# Altium schematic sheet LDP_DS_V2.0.SchDoc
size A4
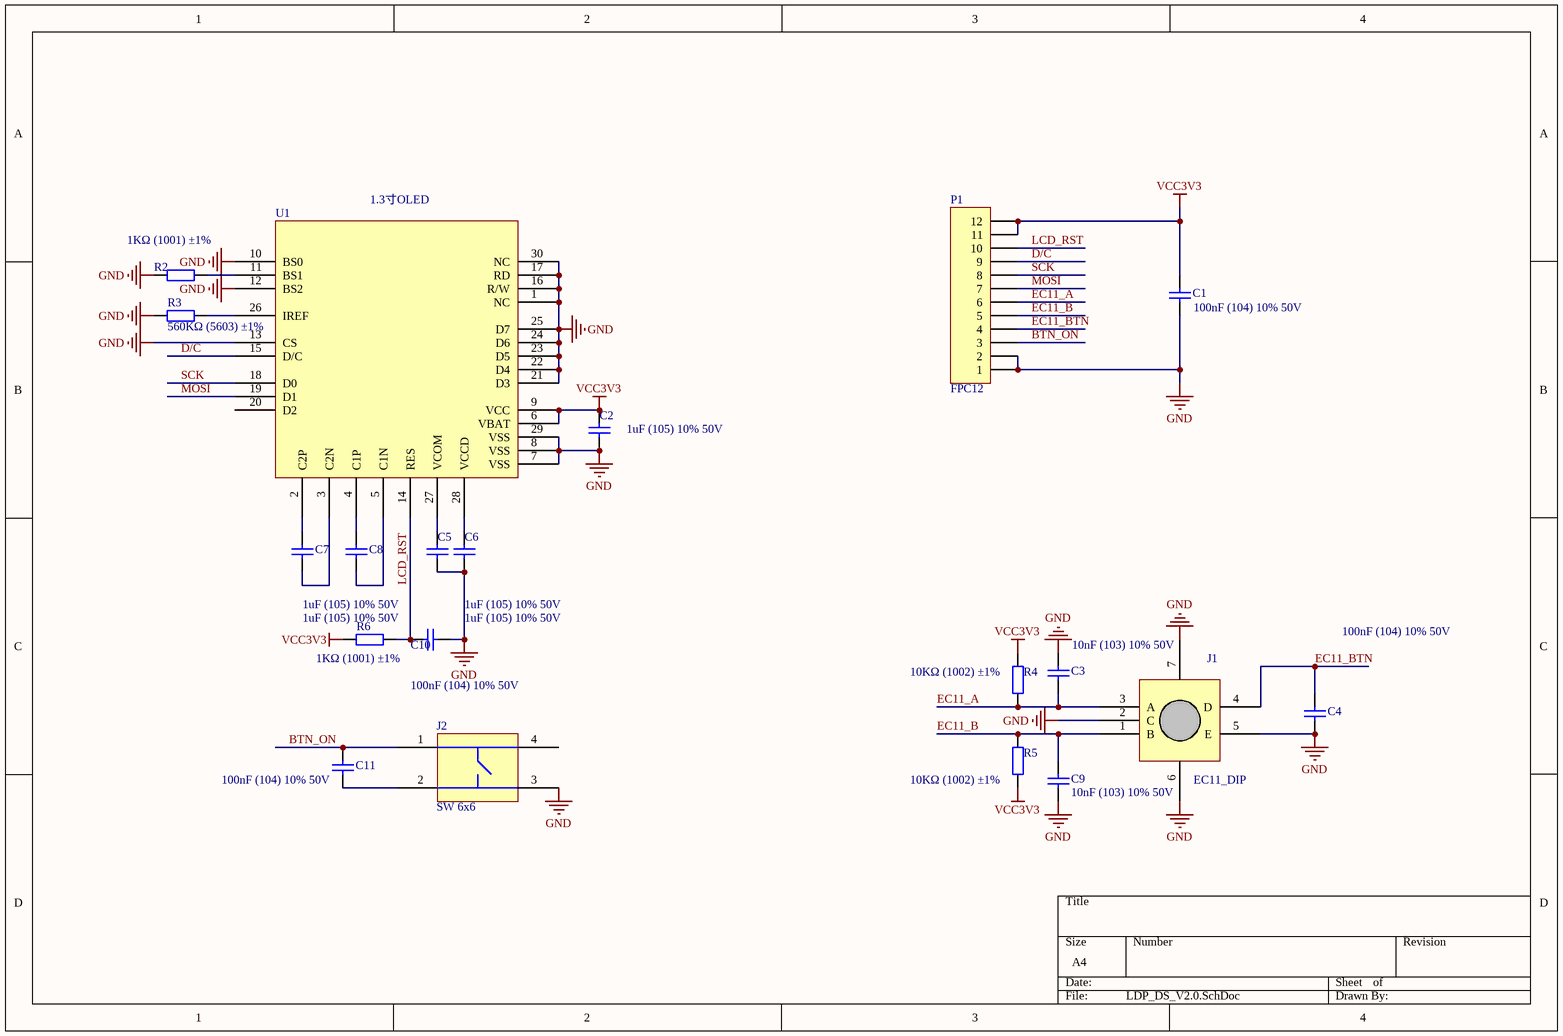
[diagram p0: LDP_DS_V2.0.SchDoc]

## Parts
C1  100nF (104) 10% 50V  [0603_C]
C2  1uF (105) 10% 50V  [0603_C]
C3  10nF (103) 10% 50V  [0603_C]
C4  100nF (104) 10% 50V  [0603_C]
C5  1uF (105) 10% 50V  [0603_C]
C6  1uF (105) 10% 50V  [0603_C]
C7  1uF (105) 10% 50V  [0603_C]
C8  1uF (105) 10% 50V  [0603_C]
C9  10nF (103) 10% 50V  [0603_C]
C10  100nF (104) 10% 50V  [0603_C]
C11  100nF (104) 10% 50V  [0603_C]
J1  EC11_DIP  [EC11_DIP]
J2  SW 6x6  [SW 6x6]
P1  FPC12  [FPC_12]
R2  1KΩ (1001) ±1%  [0603_R]
R3  560KΩ (5603) ±1%  [0603_R]
R4  10KΩ (1002) ±1%  [0603_R]
R5  10KΩ (1002) ±1%  [0603_R]
R6  1KΩ (1001) ±1%  [0603_R]
U1  1.3寸OLED  [1.3寸OLED]

## Nets
GND: C1.1 C2.1 C3.2 C4.1 C5.1 C6.1 C9.1 C10.2 J1.2(C) J1.5(E) J1.6 J1.7 J2.3 P1.1 P1.2 R2.2 R3.1 U1.1(NC) U1.7(VSS) U1.8(VSS) U1.10(BS0) U1.12(BS2) U1.13(CS) U1.16(R/W) U1.17(RD) U1.21(D3) U1.22(D4) U1.23(D5) U1.24(D6) U1.25(D7) U1.29(VSS) U1.30(NC)
VCC3V3: C1.2 C2.2 P1.11 P1.12 R4.2 R5.1 R6.2 U1.6(VBAT) U1.9(VCC)
BTN_ON: C11.2 J2.1 P1.3
D/C: P1.9 U1.15(D/C)
EC11_A: C3.1 J1.3(A) P1.6 R4.1
EC11_B: C9.2 J1.1(B) P1.5 R5.2
EC11_BTN: C4.2 J1.4(D) P1.4
LCD_RST: C10.1 P1.10 R6.1 U1.14(RES)
MOSI: P1.7 U1.19(D1)
SCK: P1.8 U1.18(D0)
NetC5_2: C5.2 U1.27(VCOM)
NetC6_2: C6.2 U1.28(VCCD)
NetC7_1: C7.1 U1.3(C2N)
NetC7_2: C7.2 U1.2(C2P)
NetC8_1: C8.1 U1.5(C1N)
NetC8_2: C8.2 U1.4(C1P)
NetC11_1: C11.1 J2.2
NetR2_1: R2.1 U1.11(BS1)
NetR3_2: R3.2 U1.26(IREF)

Not connected (* = marked no-connect by the designer): J2 4; U1 20(D2)

## Library data of the parts
C1 C4 C10 C11 = 0603 100nF (104) 10% 50V: 贴片电容; ComponentLink1Description: 供应商链接; ComponentLink1URL: http://www.szlcsc.com/product/details_15331.html; Package: 0603; Supplier: LC; SuppliersPartNumber: C14663
C2 C5-C8 = 0603 1uF (105) 10% 50V: 贴片电容; ComponentLink1Description: 供应商链接; ComponentLink1URL: http://www.szlcsc.com/product/details_16531.html; Package: 0603; Supplier: LC; SuppliersPartNumber: C15849
C3 C9 = 0603 10nF (103) 10% 50V: 贴片电容; ComponentLink1Description: 供应商链接; ComponentLink1URL: http://www.szlcsc.com/product/details_58143.html; Package: 0603; Supplier: LC; SuppliersPartNumber: C57112
P1 = Header 12: Header, 12-Pin; LatestRevisionDate: 17-Jul-2002; LatestRevisionNote: Re-released for DXP Platform.; Publisher: Altium Limited
R2 R6 = 0603 1KΩ (1001) 1%: 贴片电阻; ComponentLink1Description: 供应商链接; ComponentLink1URL: http://www.szlcsc.com/product/details_21904.html; Package: 0603; Supplier: LC; SuppliersPartNumber: C21190
R3 = 0603 560KΩ (5603) 1%: 贴片电阻; ComponentLink1Description: 供应商链接; ComponentLink1URL: http://www.szlcsc.com/product/details_23930.html; Package: 0603; Supplier: LC; SuppliersPartNumber: C23203
R4 R5 = 0603 10KΩ (1002) 1%: 贴片电阻; ComponentLink1Description: 供应商链接; ComponentLink1URL: http://www.szlcsc.com/product/details_26547.html; Package: 0603; Supplier: LC; SuppliersPartNumber: C25804